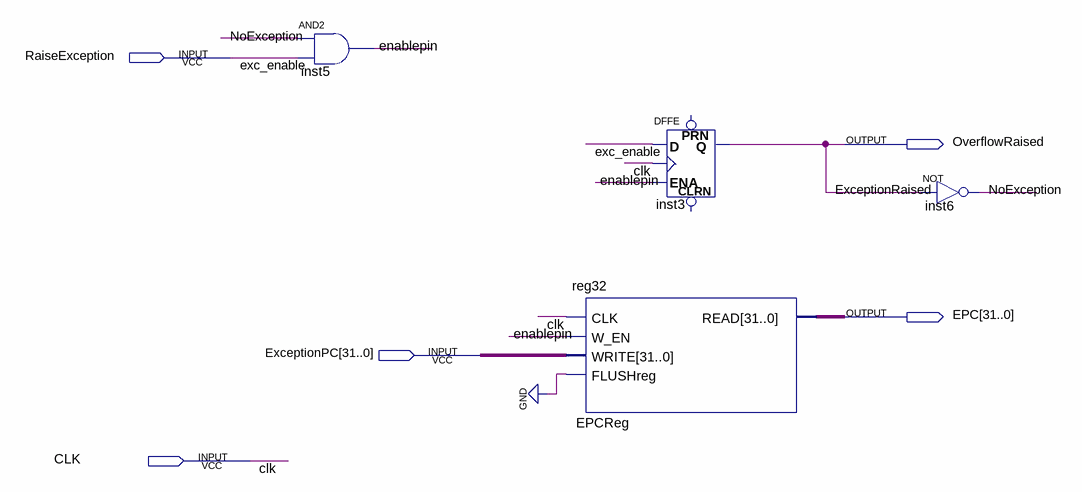
[diagram p0: schematic sheet]
// Quartus schematic OverflowHandler.bdf as structural Verilog: 4 symbols, 5 pins
module OverflowHandler (
  input  RaiseException,
  input  [31:0] ExceptionPC,
  input  CLK,
  output OverflowRaised,
  output [31:0] EPC
);

  wire enablepin, NoException;

  and inst5 (enablepin, NoException, RaiseException);
  reg32 EPCReg (.CLK(CLK), .W_EN(enablepin), .WRITE(ExceptionPC), .FLUSHreg(1'b0), .READ(EPC));
  DFFE inst3 (.D(RaiseException), .CLK(CLK), .ENA(enablepin), .Q(OverflowRaised));  // open: PRN, CLRN
  not inst6 (NoException, OverflowRaised);

  // Other names for the same wires on the sheet: exc_enable = RaiseException; ExceptionRaised = OverflowRaised
endmodule
